# EAGLE design growth_v1 (EAGLE 9.5.0)
REV: p1; TITLE: Elemental Growth
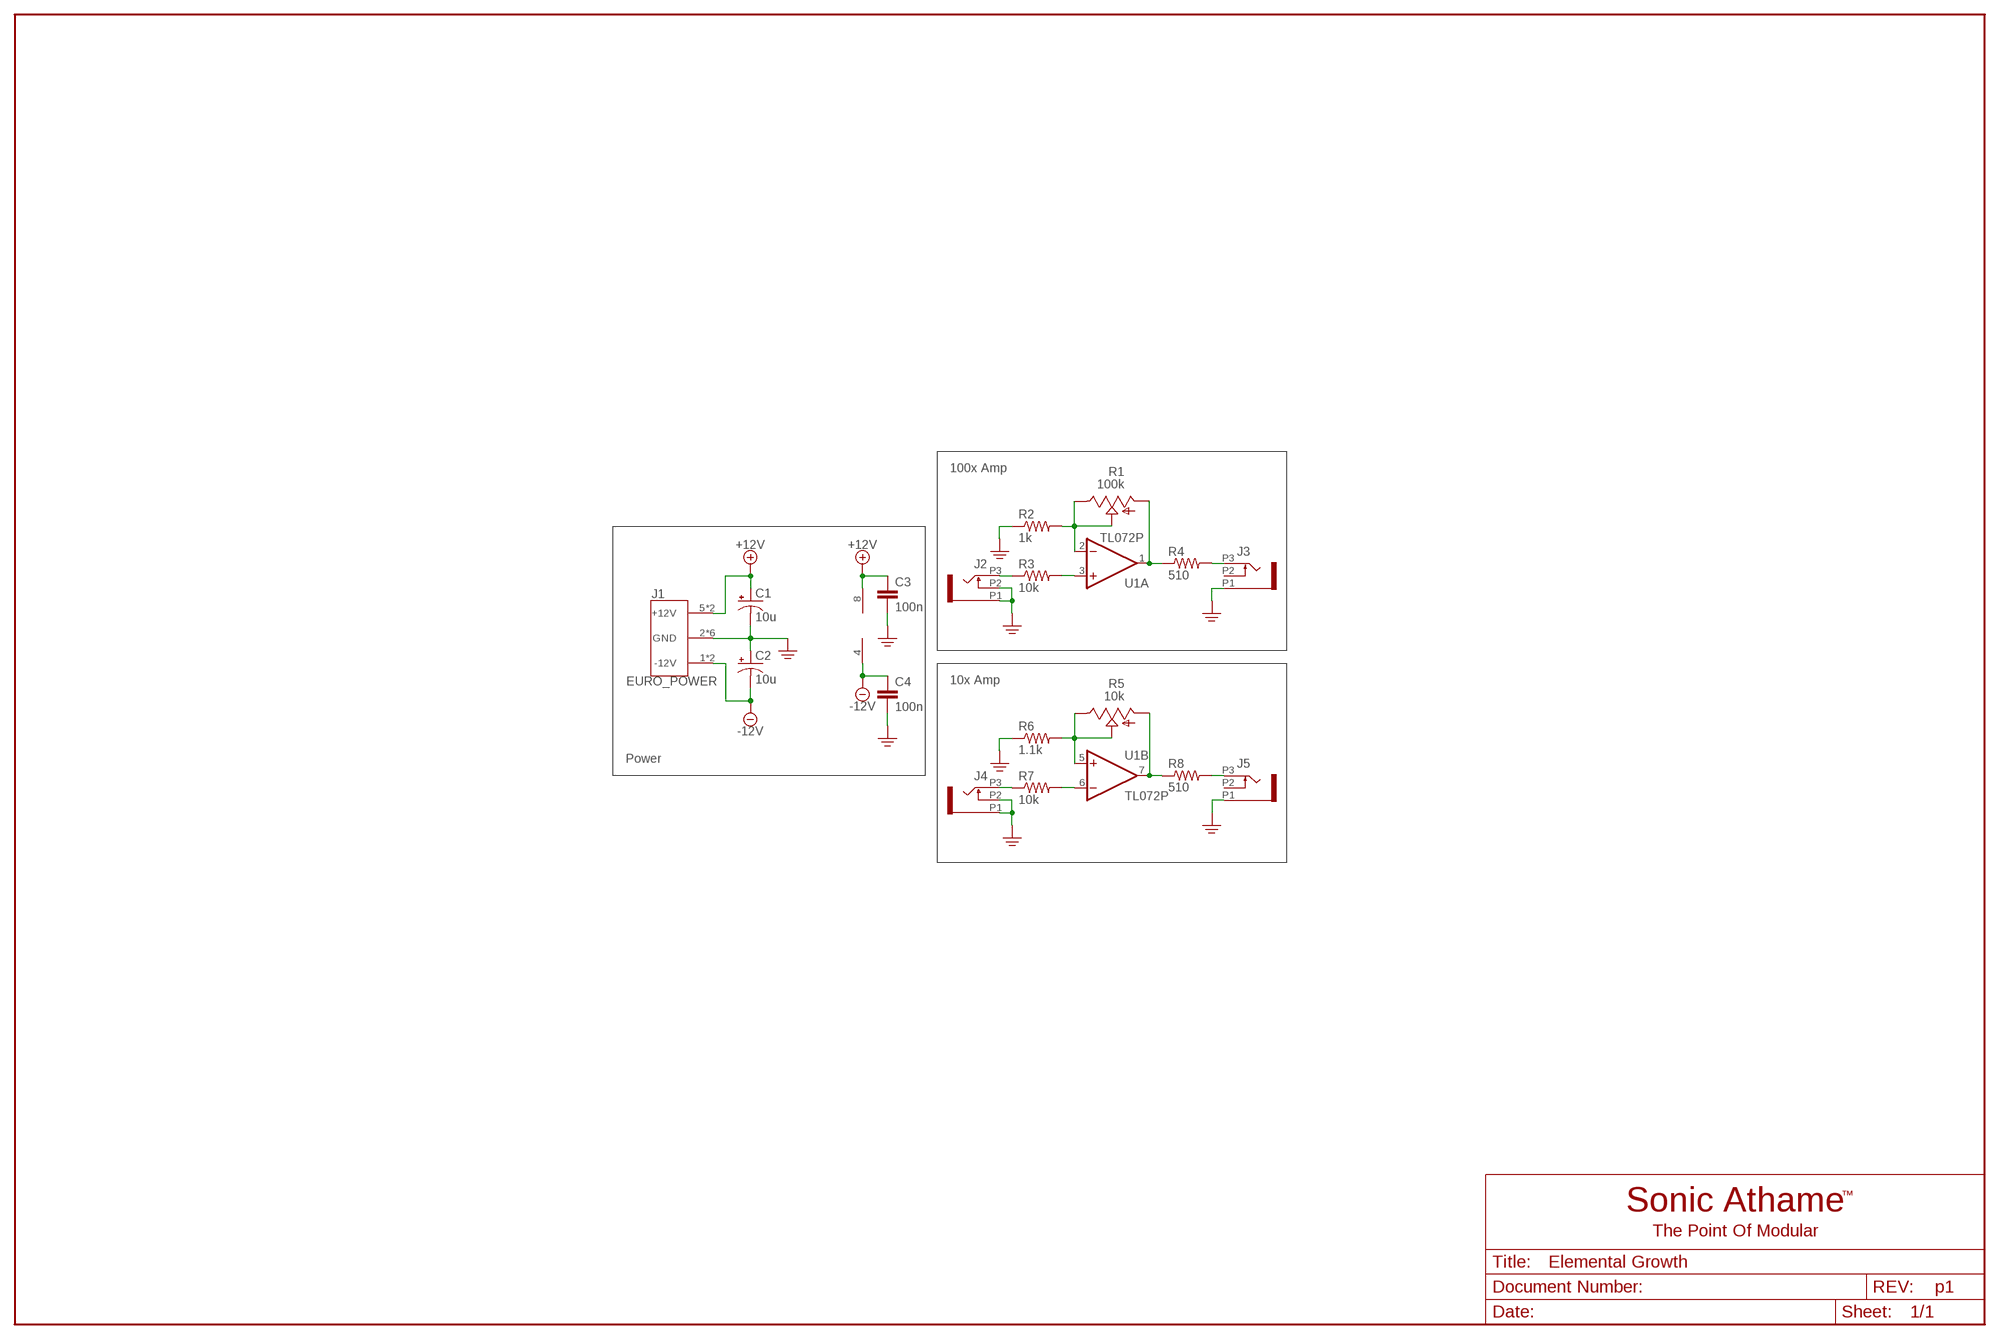
[diagram p0: schematic, sheet 1]

## Parts
C1  10u  CAP_POLLYTIC_H_L  [TT2D5L_FLIP]
C2  10u  CAP_POLLYTIC_H_L  [TT2D5L_FLIP]
C3  100n  CAP_NONPOL025-024X044  [C025-024X044]
C4  100n  CAP_NONPOL025-024X044  [C025-024X044]
J1  EURO_POWER  [EURO_POWER]
J2  WQP-PJ398SM6  [WQP_PJ_301M6]
J3  WQP-PJ398SM6  [WQP_PJ_301M6]
J4  WQP-PJ398SM6  [WQP_PJ_301M6]
J5  WQP-PJ398SM6  [WQP_PJ_301M6]
R1  100k  ALPHA_POT_VERTICALVERTICAL  [ALPHA_POT_VERTICAL]
R2  1k  RESISTOR0207/2V  [0207/2V]
R3  10k  RESISTOR0207/2V  [0207/2V]
R4  510  RESISTOR0207/2V  [0207/2V]
R5  10k  ALPHA_POT_VERTICALVERTICAL  [ALPHA_POT_VERTICAL]
R6  1.1k  RESISTOR0207/2V  [0207/2V]
R7  10k  RESISTOR0207/2V  [0207/2V]
R8  510  RESISTOR0207/2V  [0207/2V]
U1  TL072P  [DIL08]

## Nets
+12V: C1.+ C3.1 J1.5(+12V) J1.6(+12V) U1.8(P:V+)
-12V: C2.- C4.1 J1.1(-12V) J1.10(-12V) U1.4(P:V-)
GND: C1.- C2.+ C3.2 C4.2 J1.2(GND) J1.3(GND) J1.4(GND) J1.7(GND) J1.8(GND) J1.9(GND) J2.P1 J2.P2 J3.P1 J4.P1 J4.P2 J5.P1 R2.1 R6.1
N$1: R1.P$1(E) R1.P$2(S) R2.2 U1.2(A:-IN)
N$2: R1.P$3(A) R4.1 U1.1(A:OUT)
N$3: R3.2 U1.3(A:+IN)
N$4: J2.P3 R3.1
N$5: J5.P3 R8.2
N$6: J3.P3 R4.2
N$8: R5.P$3(A) R8.1 U1.7(B:OUT)
N$9: R5.P$1(E) R5.P$2(S) R6.2 U1.5(B:+IN)
N$10: R7.2 U1.6(B:-IN)
N$11: J4.P3 R7.1
Unconnected: J3.P2 J5.P2

## Notes on the sheet
- 100x Amp
- 10x Amp
- Power

## Library data of the parts
C1 C2 = SonicAthame:CAP_POL: POLARIZED CAPACITOR, American symbol
C3 C4 = SonicAthame:CAP_NONPOL: CAPACITOR, European symbol; SPICEPREFIX: C
J1 = SonicAthame:EURO_POWER
J2-J5 = SonicAthame:WQP-PJ398SM
R1 R5 = SonicAthame:ALPHA_POT_VERTICAL
R2-R4 R6-R8 = SonicAthame:RESISTOR: RESISTOR, American symbol; SPICEPREFIX: R
U1 = SonicAthame:TL072: OP AMP

## Board
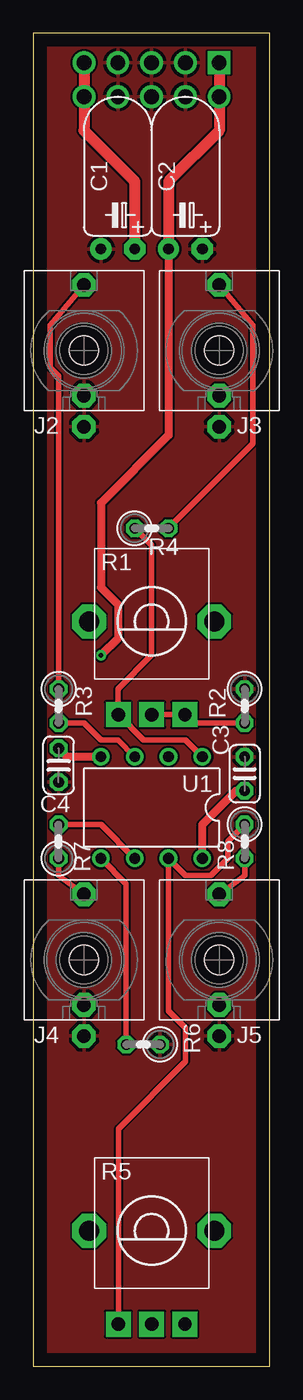
[diagram p1: board, top side]
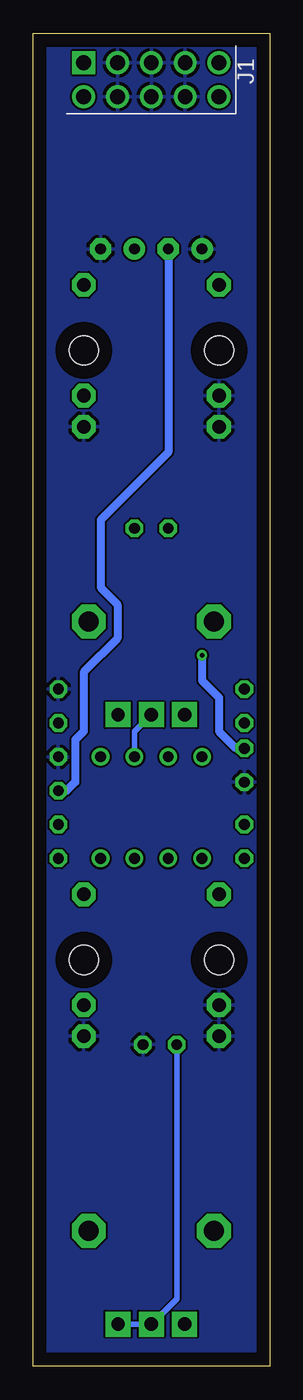
[diagram p2: board, bottom side, seen from below]

Size 17.76 x 100 mm. Coordinates in mm from the lower left corner, seen from the top.
Outline: 0,0 17.76,0 17.76,100 0,100 0,0
Copper layers (1*16): Top 0.035mm / dielectric 1.5mm / Bottom 0.035mm
Design rules "default": minimum track width 6mil, minimum drill 0.35mm, track to track 6mil, track to pad 6mil, pad to pad 6mil, via to via 6mil, smd to smd 6mil, copper to edge 40mil, drill to drill 6mil, minimum pad ring 10mil, minimum via ring 8mil, stop-mask expansion 4mil, vias tented up to drill 0mil, thermal gap 10mil

### Footprints (pad centres in the part's own frame; a part is rotated, then mirrored left to right if it is on the bottom)
TT2D5L_FLIP = drill 0.813 pad 1.6 octagon: + 1.27,0 | drill 0.813 pad 1.6: - -1.27,0
C025-024X044 = drill 0.813 octagon: 1 -1.27,0; 2 1.27,0
EURO_POWER = drill 1.105 pad 1.705 square: 1 -5.08,1.27 | drill 1.105 pad 1.705: 2 -2.54,1.27; 3 0,1.27; 4 2.54,1.27; 5 5.08,1.27; 6 5.08,-1.27; 7 2.54,-1.27; 8 0,-1.27; 9 -2.54,-1.27; 10 -5.08,-1.27
WQP_PJ_301M6 = drill 1.016 pad 1.778 octagon: P1 0,-5.715; P2 0,-3.38; P3 0,4.92 | hole 2.2: 0,0
ALPHA_POT_VERTICAL = drill 1 pad 1.88 square: P$1 -2.5,7; P$2 0,7; P$3 2.5,7 | drill 1.5 pad 2.54 octagon: P$4 -4.7,0; P$5 4.7,0
0207/2V = drill 0.813 octagon: 1 -1.27,0; 2 1.27,0
DIL08 = drill 0.813 pad 1.27: 1 -3.81,-3.81; 2 -1.27,-3.81; 3 1.27,-3.81; 4 3.81,-3.81; 5 3.81,3.81; 6 1.27,3.81; 7 -1.27,3.81; 8 -3.81,3.81

### Placement (x,y rotation side)
C1  6.35,83.82 0 top
C2  11.43,83.82 0 top
C3  15.88,44.45 90 top
C4  1.91,45.09 270 top
J1  8.89,96.52 0 bottom
J2  3.81,76.2 0 top
J3  13.97,76.2 0 top
J4  3.81,30.48 0 top
J5  13.97,30.48 0 top
R1  8.89,55.88 180 top
R2  15.88,49.53 270 top
R3  1.91,49.53 270 top
R4  8.89,62.87 0 top
R5  8.89,10.16 180 top
R6  8.26,24.13 180 top
R7  1.91,39.37 90 top
R8  15.88,39.37 270 top
U1  8.89,41.91 180 top

### Tracks (layer width: path | path; a pad name or v marks a point on that pad's centre or on a via)
+12V
  Top 0.61: U1.8 12.7,40.64 15.24,43.18 C3.1
  Top 0.813: J1.5 J1.6 3.81,92.71 7.62,88.9 C1.+
  Bottom 0.61: C3.1 15.24,43.18 14.61,43.81 14.61,46.99 13.97,47.62 13.97,52.07 11.43,54.61 11.43,57.15 12.7,58.42 12.7,63.5 7.62,68.58 C1.+
-12V  (via drill 0.35)
  Top 0.61: U1.4 2.54,45.72 C4.1 | C2.- 10.16,69.85 5.08,64.77 5.08,58.42 6.35,57.15 6.35,54.61 v5.08,53.34
  Top 0.813: J1.1 J1.10 13.97,92.71 10.16,88.9 C2.-
  Bottom 0.61: v5.08,53.34 5.08,51.44 3.81,50.16 3.81,47.62 2.54,46.35 C4.1
GND
  pour Bottom: 0,0 17.78,0 17.78,100.33 0,100.33
  pour Top: 0,0 17.78,0 17.78,100.33 0,100.33
N$1
  Top 0.406: R1.P$2 R1.P$1 12.01,48.26 R2.2
  Bottom 0.406: U1.2 10.16,47.61 R1.P$2
N$2
  Top 0.406: U1.1 11.43,46.99 8.28,46.99 R1.P$3 6.35,48.92 6.35,50.8 8.89,53.34 8.89,61.59 R4.1
N$3
  Top 0.406: U1.3 6.35,46.99 5.08,46.99 3.81,48.26 R3.2
N$4
  Top 0.406: R3.1 1.91,74.3 1.27,74.93 1.27,78.11 J2.P3
N$5
  Top 0.406: J5.P3 15.88,36.83 R8.2
N$6
  Top 0.406: J3.P3 16.51,78.11 16.51,69.22 R4.2
N$8
  Top 0.406: R8.1 14.61,39.37 14.61,38.1 13.34,36.83 11.43,36.83 U1.7 10.16,26.67 11.43,25.4 11.43,22.86 6.39,17.82 R5.P$3
N$9
  Top 0.406: R6.2 6.99,36.2 U1.5
  Bottom 0.406: R5.P$1 R5.P$2 6.99,5.07 R6.2
N$10
  Top 0.406: U1.6 5.08,40.64 R7.2
N$11
  Top 0.406: J4.P3 1.91,36.83 R7.1

### Text on the board
tValues: 100x In | 100x Out | 100x Setting | 10x In | 10x Out | 10x Setting
bValues: Sonic Athame™ | The Point of Modular | Elemental Growth | Sonic Athame is fully open-hardware and open-software!! / Find schematics and code on the official GitHub: / https://github.com/nimaid/Sonic-Athame-eurorack | Prototype v1